# EAGLE schematic main (EAGLE 5.03)
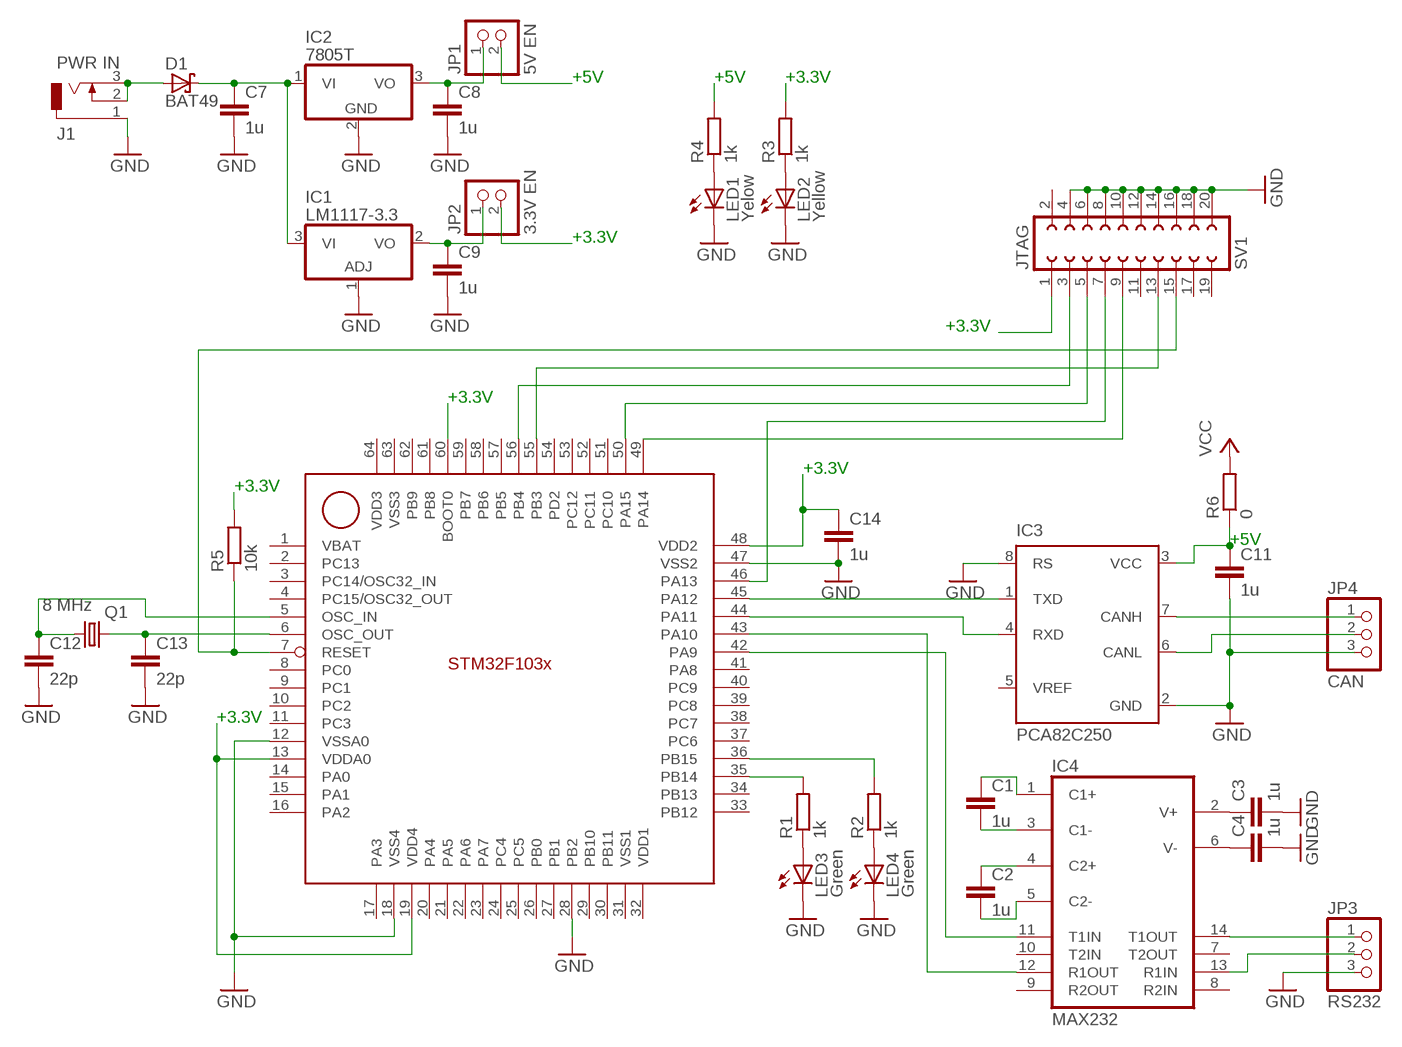
[diagram p0: schematic, sheet 1]

## Parts
C1  1u  C2,5-3  [C2.5-3]
C2  1u  C2,5-3  [C2.5-3]
C3  1u  C2,5-3  [C2.5-3]
C4  1u  C2,5-3  [C2.5-3]
C7  1u  C2,5-3  [C2.5-3]
C8  1u  C2,5-3  [C2.5-3]
C9  1u  C2,5-3  [C2.5-3]
C11  1u  C2,5-3  [C2.5-3]
C12  22p  C2,5-3  [C2.5-3]
C13  22p  C2,5-3  [C2.5-3]
C14  1u  C2,5-3  [C2.5-3]
D1  BAT49  [DO41-10]
IC1  LM1117-3.3  317T  [TO220H]
IC2  7805T  [TO220H]
IC3  PCA82C250  [DIL08]
IC4  MAX232  [DIL16]
J1  PWR IN  DCJ0202  [DCJ0202]
JP1  5V EN  PINHD-1X2  [1X02]
JP2  3.3V EN  PINHD-1X2  [1X02]
JP3  RS232  PINHD-1X3  [1X03]
JP4  CAN  PINHD-1X3  [1X03]
LED1  Yelow  LED3MM  [LED3MM]
LED2  Yellow  LED3MM  [LED3MM]
LED3  Green  LED3MM  [LED3MM]
LED4  Green  LED3MM  [LED3MM]
Q1  8 MHz  CRYSTALHC49U-V  [HC49U-V]
R1  1k  R-EU_0204/7  [0204/7]
R2  1k  R-EU_0204/7  [0204/7]
R3  1k  R-EU_0204/7  [0204/7]
R4  1k  R-EU_0204/7  [0204/7]
R5  10k  R-EU_0204/7  [0204/7]
R6  0  R-EU_0204/7  [0204/7]
SV1  JTAG  FE10-2  [FE10-2]
U$1  STM32F103_64PIN  [SQFP-S-10X10-64]

## Nets
+3.3V: C14.1 JP2.2 R3.2 R5.2 SV1.1 U$1.13(VDDA0) U$1.19(VDD4) U$1.48(VDD2) U$1.60(BOOT0)
+5V: C11.1 IC3.3(VCC) JP1.2 R4.2 R6.1
GND: C3.2 C4.2 C7.2 C8.2 C9.2 C11.2 C12.2 C13.2 C14.2 IC1.1(ADJ) IC2.2(GND) IC3.2(GND) IC3.8(RS) J1.1 JP3.3 JP4.3 LED1.K(C) LED2.K(C) LED3.K(C) LED4.K(C) SV1.4 SV1.6 SV1.8 SV1.10 SV1.12 SV1.14 SV1.16 SV1.18 SV1.20 U$1.12(VSSA0) U$1.18(VSS4) U$1.28(PB2) U$1.47(VSS2)
N$1: LED3.A R1.1
N$2: LED4.A R2.1
N$3: LED2.A R3.1
N$4: LED1.A R4.1
N$5: C7.1 D1.C IC1.3(VI) IC2.1(VI)
N$6: C9.1 IC1.2(VO) JP2.1
N$7: IC3.1(TXD) U$1.45(PA12)
N$8: C8.1 IC2.3(VO) JP1.1
N$9: C12.1 Q1.2 U$1.5(OSC_IN)
N$10: C13.1 Q1.1 U$1.6(OSC_OUT)
N$11: R5.1 SV1.15 U$1.7(RESET)
N$12: IC3.4(RXD) U$1.44(PA11)
N$13: R1.2 U$1.35(PB14)
N$14: R2.2 U$1.36(PB15)
N$15: IC3.7(CANH) JP4.1
N$16: IC3.6(CANL) JP4.2
N$17: C1.2 IC4.3(C1-)
N$18: C1.1 IC4.1(C1+)
N$19: C2.1 IC4.4(C2+)
N$20: C2.2 IC4.5(C2-)
N$21: C3.1 IC4.2(V+)
N$22: C4.1 IC4.6(V-)
N$23: IC4.14(T1OUT) JP3.1
N$24: IC4.13(R1IN) JP3.2
N$25: IC4.11(T1IN) U$1.42(PA9)
N$26: IC4.12(R1OUT) U$1.43(PA10)
N$27: SV1.9 U$1.49(PA14)
N$28: SV1.5 U$1.50(PA15)
N$29: SV1.7 U$1.46(PA13)
N$30: SV1.3 U$1.56(PB4)
N$31: SV1.13 U$1.55(PB3)
N$32: D1.A J1.2 J1.3
VCC: R6.2
Unconnected: IC3.5(VREF) IC4.7(T2OUT) IC4.8(R2IN) IC4.9(R2OUT) IC4.10(T2IN) SV1.2 SV1.11 SV1.17 SV1.19 U$1.2(PC13) U$1.3(PC14/OSC32_IN) U$1.4(PC15/OSC32_OUT) U$1.8(PC0) U$1.9(PC1) U$1.10(PC2) U$1.11(PC3) U$1.14(PA0) U$1.15(PA1) U$1.16(PA2) U$1.17(PA3) U$1.20(PA4) U$1.21(PA5) U$1.22(PA6) U$1.23(PA7) U$1.24(PC4) U$1.25(PC5) U$1.26(PB0) U$1.27(PB1) U$1.29(PB10) U$1.30(PB11) U$1.33(PB12) U$1.34(PB13) U$1.37(PC6) U$1.38(PC7) U$1.39(PC8) U$1.40(PC9) U$1.41(PA8) U$1.51(PC10) U$1.52(PC11) U$1.53(PC12) U$1.54(PD2) U$1.57(PB5) U$1.58(PB6) U$1.59(PB7) U$1.61(PB8) U$1.62(PB9)

## Notes on the sheet
- +5V | +5V | +3.3V
- +3.3V
- +3.3V
- +3.3V
- +3.3V
- +3.3V
- +5V
- +3.3V

## Power pins joined to a net without a drawn wire
GND: IC4.15(GND)
VBAT: U$1.1(VBAT)
VCC: IC4.16(VCC)
VDD1: U$1.32(VDD1)
VDD3: U$1.64(VDD3)
VSS1: U$1.31(VSS1)
VSS3: U$1.63(VSS3)

## Library data of the parts
C1-C4 C7-C9 C11-C14 = capacitor-wima:C: CAPACITOR naming: grid - package width
D1 = diode:BAT49: DIODE small signal diode
IC1 = linear:*317: Positive VOLTAGE REGULATOR
IC2 = linear:78*: Positive VOLTAGE REGULATOR Source: http://cache.national.com/ds/LM/LM78L05.pdf http://www.fairchildsemi.com/ds/LM/LM7805.pdf
IC3 = micro-philips:PCA82C250: CAN CONTROLLER INTERFACE
IC4 = maxim:MAX232: RS232 TRANSEIVER
J1 = con-jack:DCJ0202: DC POWER JACK Source: DCJ0202.pdf
JP1 JP2 = pinhead:PINHD-1X2: PIN HEADER
JP3 JP4 = pinhead:PINHD-1X3: PIN HEADER
LED1-LED4 = led:LED: LED OSRAM: - CHIPLED LG R971, LG N971, LY N971, LG Q971, LY Q971, LO R971, LY R971 LH N974, LH R974 LS Q976, LO Q976, LY Q976 LO Q996 - Hyper CHIPLED LW Q18S LB Q993, LB Q99A, LB R99A - SideLED LS A670, LO A670, LY A670, LG A670, LP A670 LB A673, LV A673, LT A673, LW A673 LH A674 LY A675 LS A676, LA A676, LO A676, LY A676, LW A676 LS A679, LY A679, LG A679 - Hyper Micro SIDELED® LS Y876, LA Y876, LO Y876, LY Y876 LT Y87S - SmartLED LW L88C, LW L88S LB L89C, LB L89S, LG L890 LS L89K, LO L89K, LY L89K LS L896, LA L896, LO L896, LY L896 - TOPLED LS T670, LO T670, LY T670, LG T670, LP T670 LSG T670, LSP T670, LSY T670, LOP T670, LYG T670 LG T671, LOG T671, LSG T671 LB T673, LV T673, LT T673, LW T673 LH T674 LS T676, LA T676, LO T676, LY T676, LB T676, LH T676, LSB T676, LW T676 LB T67C, LV T67C, LT T67C, LS T67K, LO T67K, LY T67K, LW E67C LS E67B, LA E67B, LO E67B, LY E67B, LB E67C, LV E67C, LT E67C LW T67C LS T679, LY T679, LG T679 LS T770, LO T770, LY T770, LG T770, LP T770 LB T773, LV T773, LT T773, LW T773 LH T774 LS E675, LA E675, LY E675, LS T675 LS T776, LA T776, LO T776, LY T776, LB T776 LHGB T686 LT T68C, LB T68C - Hyper Mini TOPLED® LB M676 - Mini TOPLED Santana® LG M470 LS M47K, LO M47K, LY M47K Source: http://www.osram.convergy.de LUXEON: - LUMILED® LXK2-PW12-R00, LXK2-PW12-S00, LXK2-PW14-U00, LXK2-PW14-V00 LXK2-PM12-R00, LXK2-PM12-S00, LXK2-PM14-U00 LXK2-PE12-Q00, LXK2-PE12-R00, LXK2-PE12-S00, LXK2-PE14-T00, LXK2-PE14-U00 LXK2-PB12-K00, LXK2-PB12-L00, LXK2-PB12-M00, LXK2-PB14-N00, LXK2-PB14-P00, LXK2-PB14-Q00 LXK2-PR12-L00, LXK2-PR12-M00, LXK2-PR14-Q00, LXK2-PR14-R00 LXK2-PD12-Q00, LXK2-PD12-R00, LXK2-PD12-S00 LXK2-PH12-R00, LXK2-PH12-S00 LXK2-PL12-P00, LXK2-PL12-Q00, LXK2-PL12-R00 Source: www.luxeon.com KINGBRIGHT: KA-3528ASYC Source: www.kingbright.com
Q1 = crystal:CRYSTAL: CRYSTAL
R1-R6 = rcl:R-EU_: RESISTOR, European symbol
SV1 = con-lsta:FE10-2: FEMALE HEADER
U$1 = STM32:STM32F103_64PIN